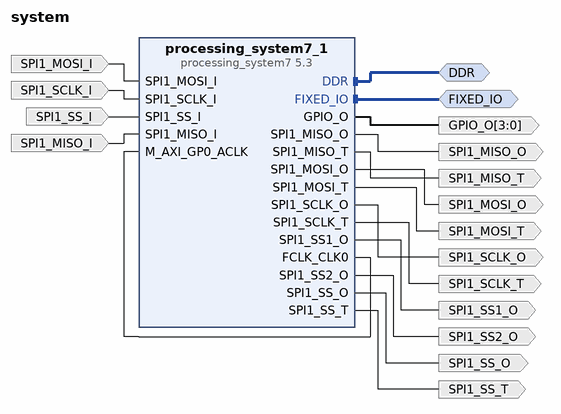
[diagram p0: block diagram of the top level]
# Vivado block design system, Vivado 2013.4
create_bd_design system

create_bd_intf_port -mode Master -vlnv xilinx.com:interface:ddrx_rtl:1.0 DDR
create_bd_intf_port -mode Master -vlnv xilinx.com:display_processing_system7:fixedio_rtl:1.0 FIXED_IO
create_bd_port -dir O SPI1_MOSI_O
create_bd_port -dir O SPI1_MOSI_T
create_bd_port -dir O SPI1_SCLK_T
create_bd_port -dir I SPI1_MOSI_I
create_bd_port -dir O SPI1_SS2_O
create_bd_port -dir I SPI1_SCLK_I
create_bd_port -dir O SPI1_SCLK_O
create_bd_port -dir O SPI1_SS_O
create_bd_port -dir O SPI1_SS1_O
create_bd_port -dir O SPI1_MISO_T
create_bd_port -dir I SPI1_SS_I
create_bd_port -dir I SPI1_MISO_I
create_bd_port -dir O SPI1_MISO_O
create_bd_port -dir O SPI1_SS_T
create_bd_port -dir O -from 3 -to 0 GPIO_O

create_bd_cell -type ip -vlnv xilinx.com:ip:processing_system7:5.3 processing_system7_1
set_property -dict [list \
  CONFIG.PCW_ENET0_PERIPHERAL_ENABLE 0 \
  CONFIG.PCW_SD0_PERIPHERAL_ENABLE 0 \
  CONFIG.PCW_SPI1_PERIPHERAL_ENABLE 1 \
  CONFIG.PCW_USB0_PERIPHERAL_ENABLE 0 \
  CONFIG.PCW_GPIO_MIO_GPIO_ENABLE 0 \
  CONFIG.PCW_GPIO_EMIO_GPIO_ENABLE 1 \
  CONFIG.PCW_GPIO_EMIO_GPIO_IO 4 \
] [get_bd_cells processing_system7_1]

# ---- connections ----

connect_bd_intf_net [get_bd_intf_ports DDR] [get_bd_intf_pins processing_system7_1/DDR]
connect_bd_intf_net [get_bd_intf_ports FIXED_IO] [get_bd_intf_pins processing_system7_1/FIXED_IO]
connect_bd_net [get_bd_pins processing_system7_1/SPI1_MOSI_O] [get_bd_ports SPI1_MOSI_O]
connect_bd_net [get_bd_pins processing_system7_1/SPI1_MOSI_T] [get_bd_ports SPI1_MOSI_T]
connect_bd_net [get_bd_pins processing_system7_1/SPI1_SCLK_T] [get_bd_ports SPI1_SCLK_T]
connect_bd_net [get_bd_ports SPI1_MOSI_I] [get_bd_pins processing_system7_1/SPI1_MOSI_I]
connect_bd_net [get_bd_pins processing_system7_1/SPI1_SS2_O] [get_bd_ports SPI1_SS2_O]
connect_bd_net [get_bd_ports SPI1_SCLK_I] [get_bd_pins processing_system7_1/SPI1_SCLK_I]
connect_bd_net [get_bd_pins processing_system7_1/SPI1_SCLK_O] [get_bd_ports SPI1_SCLK_O]
connect_bd_net [get_bd_pins processing_system7_1/SPI1_SS_O] [get_bd_ports SPI1_SS_O]
connect_bd_net [get_bd_pins processing_system7_1/SPI1_SS1_O] [get_bd_ports SPI1_SS1_O]
connect_bd_net [get_bd_pins processing_system7_1/SPI1_MISO_T] [get_bd_ports SPI1_MISO_T]
connect_bd_net [get_bd_ports SPI1_SS_I] [get_bd_pins processing_system7_1/SPI1_SS_I]
connect_bd_net [get_bd_ports SPI1_MISO_I] [get_bd_pins processing_system7_1/SPI1_MISO_I]
connect_bd_net [get_bd_pins processing_system7_1/SPI1_MISO_O] [get_bd_ports SPI1_MISO_O]
connect_bd_net [get_bd_pins processing_system7_1/SPI1_SS_T] [get_bd_ports SPI1_SS_T]
connect_bd_net [get_bd_pins processing_system7_1/FCLK_CLK0] [get_bd_pins processing_system7_1/M_AXI_GP0_ACLK]
connect_bd_net [get_bd_pins processing_system7_1/GPIO_O] [get_bd_ports GPIO_O]

validate_bd_design
save_bd_design
